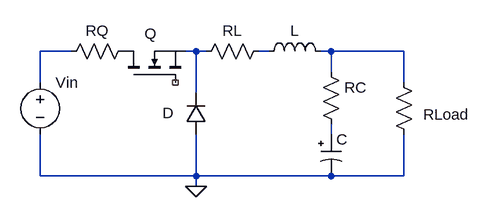
[diagram p0: schematic ccm_buck.asc]
ccm_buck.asc, the LTspice schematic file:
Version 4
SHEET 1 880 680
WIRE -288 64 -336 64
WIRE -96 64 -112 64
WIRE -80 64 -96 64
WIRE 16 64 0 64
WIRE 112 64 96 64
WIRE 224 64 112 64
WIRE 112 96 112 64
WIRE -336 112 -336 64
WIRE 224 112 224 64
WIRE -96 128 -96 64
WIRE 112 192 112 176
WIRE -336 256 -336 192
WIRE -96 256 -96 192
WIRE -96 256 -336 256
WIRE 112 256 -96 256
WIRE 224 256 224 192
WIRE 224 256 112 256
WIRE -96 272 -96 256
FLAG -96 272 0
SYMBOL res 208 96 R0
WINDOW 0 46 65 Left 2
SYMATTR InstName RLoad
SYMATTR Value ""
SYMBOL polcap 96 192 R0
WINDOW 3 42 151 Left 2
SYMATTR InstName C
SYMATTR Value ""
SYMATTR Description Capacitor
SYMATTR Type cap
SYMATTR SpiceLine V=50 Irms=22m Rser=3.9 Lser=0
SYMBOL res 96 80 R0
SYMATTR InstName RC
SYMATTR Value ""
SYMBOL ind 0 80 R270
WINDOW 0 32 56 VTop 2
WINDOW 3 5 56 VBottom 2
SYMATTR InstName L
SYMATTR Value ""
SYMBOL res 16 48 R90
WINDOW 0 0 56 VBottom 2
WINDOW 3 32 56 VTop 2
SYMATTR InstName RL
SYMATTR Value ""
SYMBOL diode -80 192 R180
WINDOW 0 50 33 Left 2
WINDOW 3 24 0 Left 2
SYMATTR InstName D
SYMATTR Value ""
SYMBOL nmos -208 112 R270
WINDOW 0 75 33 VRight 2
SYMATTR InstName Q
SYMATTR Value ""
SYMBOL res -192 48 R90
WINDOW 0 0 56 VBottom 2
WINDOW 3 66 56 VBottom 2
SYMATTR InstName RQ
SYMATTR Value ""
SYMBOL voltage -336 96 R0
SYMATTR InstName Vin
SYMATTR Value ""

The netlist it stands for:
* ccm_buck.asc
RLoad N004 0
C N005 0 V=50 Irms=22m Rser=3.9 Lser=0
RC N004 N005
L N003 N004
RL N003 N002
D 0 N002
M§Q P001 NC_01 N002 N002
RQ P001 N001
Vin N001 0
.model D D
.lib standard.dio
.model NMOS NMOS
.model PMOS PMOS
.lib standard.mos
.backanno
.end